# EAGLE board 8iPanel (EAGLE 6.6.0)
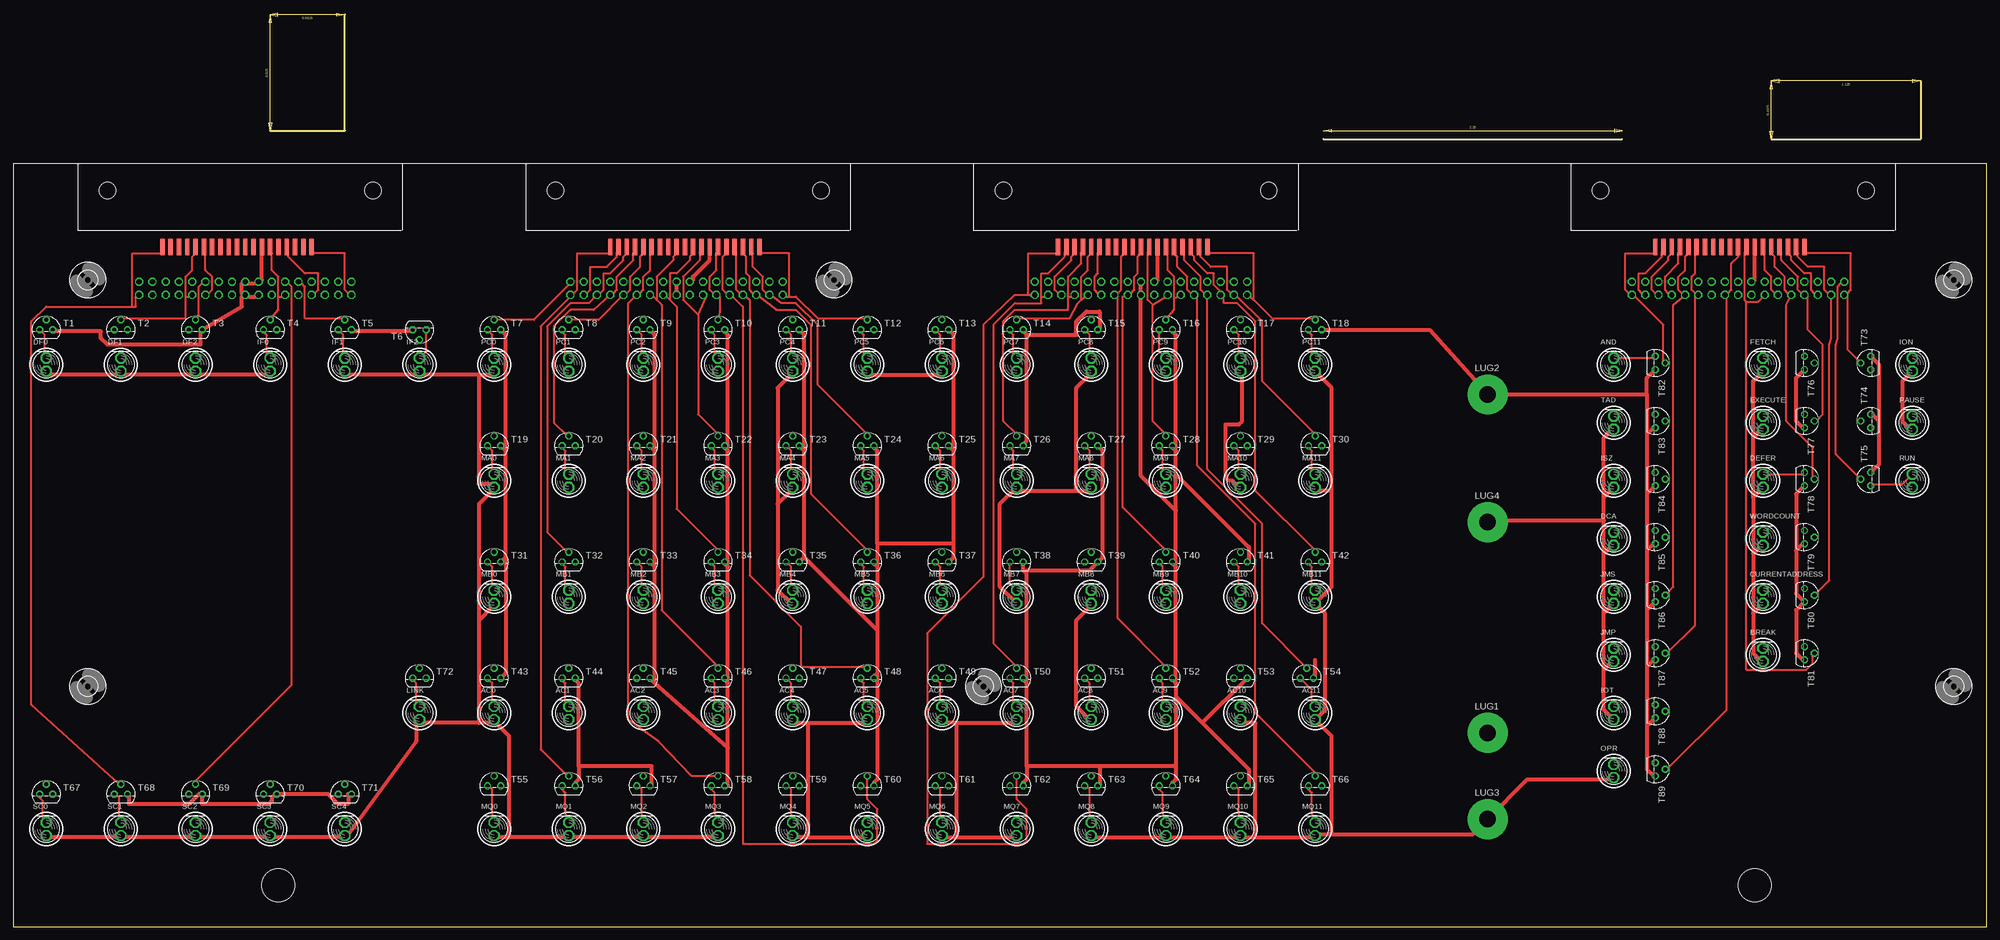
[diagram p2: board, top side]
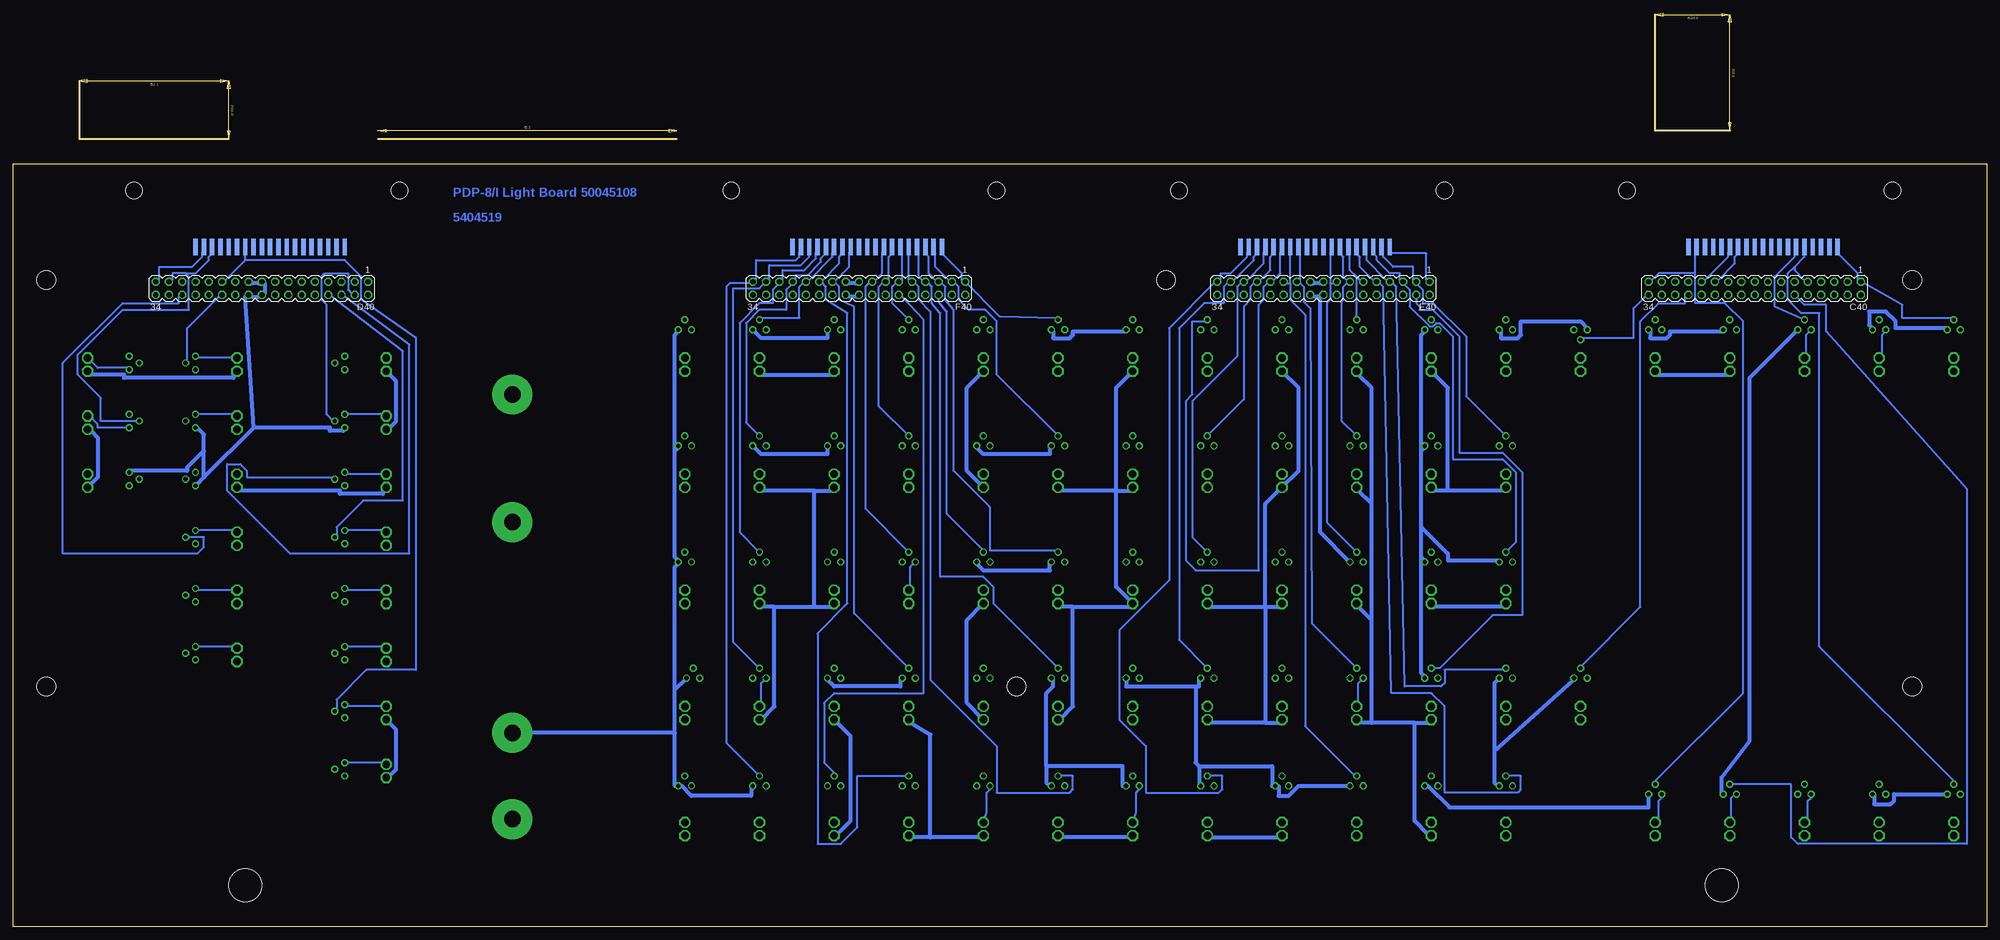
[diagram p3: board, bottom side, seen from below]

Size 377.82 x 174.62 mm. Coordinates in mm from the lower left corner, seen from the top.
Outline: 49.21,152.4 63.5,152.4 63.5,174.62
Outline: 336.55,150.81 365.12,150.81 365.12,161.93
Outline: 250.82,150.81 307.98,150.81
Outline: 0,0 377.82,0 377.82,146.05 0,146.05 0,0
Copper layers (1*16): Top 0.035mm / dielectric 1.5mm / Bottom 0.035mm
Design rules "15mils": minimum track width 15mil, minimum drill 24mil, track to track 15mil, track to pad 10mil, pad to pad 10mil, via to via 10mil, smd to smd 10mil, copper to edge 25mil, drill to drill 10mil, minimum pad ring 10mil, minimum via ring 8mil, stop-mask expansion 0mil, vias tented up to drill 0mil, thermal gap 10mil
Net classes: 1 supply: width 0.762 mm
Holes 6.35 mm at 50.8,7.94 333.38,7.94

## Footprints (pad centres in the part's own frame; a part is rotated, then mirrored left to right if it is on the bottom)
BULB = drill 1.422 octagon: A 0,0; B 0,2.54
MA17-2 = drill 1.016 octagon: 1 -20.32,-1.27; 2 -20.32,1.27; 3 -17.78,-1.27; 4 -17.78,1.27; 5 -15.24,-1.27; 6 -15.24,1.27; 7 -12.7,-1.27; 8 -12.7,1.27; 9 -10.16,-1.27; 10 -10.16,1.27; 11 -7.62,-1.27; 12 -7.62,1.27; 13 -5.08,-1.27; 14 -5.08,1.27; 15 -2.54,-1.27; 16 -2.54,1.27; 17 0,-1.27; 18 0,1.27; 19 2.54,-1.27; 20 2.54,1.27; 21 5.08,-1.27; 22 5.08,1.27; 23 7.62,-1.27; 24 7.62,1.27; 25 10.16,-1.27; 26 10.16,1.27; 27 12.7,-1.27; 28 12.7,1.27; 29 15.24,-1.27; 30 15.24,1.27; 31 17.78,-1.27; 32 17.78,1.27; 33 20.32,-1.27; 34 20.32,1.27
FLEX19 = smd 3.175 x 0.838: 1 0,14.287; 2 0,12.7; 3 0,11.113; 4 0,9.525; 5 0,7.938; 6 0,6.35; 7 0,4.763; 8 0,3.175; 9 0,1.587; 10 0,0; 11 0,-1.587; 12 0,-3.175; 13 0,-4.763; 14 0,-6.35; 15 0,-7.938; 16 0,-9.525; 17 0,-11.113; 18 0,-12.7; 19 0,-14.287
SPADELUG = drill 3.175 pad 7.62: 1 0,0
TO92 = drill 0.813 octagon: 1 1.27,0; 2 0,1.905; 3 -1.27,0
STRAIN-RELIEF = hole 3.175: 7.62,56.515; 7.62,5.715
3,6 = hole 3.6: 0,0

## Placement (x,y rotation side)
AC0  [BULB]  92.08,39.69 0 top
AC1  [BULB]  106.36,39.69 0 top
AC2  [BULB]  120.65,39.69 0 top
AC3  [BULB]  134.94,39.69 0 top
AC4  [BULB]  149.22,39.69 0 top
AC5  [BULB]  163.51,39.69 0 top
AC6  [BULB]  177.8,39.69 0 top
AC7  [BULB]  192.09,39.69 0 top
AC8  [BULB]  206.38,39.69 0 top
AC9  [BULB]  220.66,39.69 0 top
AC10  [BULB]  234.95,39.69 0 top
AC11  [BULB]  249.24,39.69 0 top
AND  [BULB]  306.39,106.36 0 top
BREAK  [BULB]  334.96,50.8 0 top
C40  [MA17-2]  44.45,122.24 180 bottom
C40BOT  FLEX19  [FLEX19]  42.86,130.18 90 top
C40TOP  FLEX19  [FLEX19]  42.86,130.18 270 bottom
CURRENTADDRESS  [BULB]  334.96,61.91 0 top
D40  [MA17-2]  330.2,122.24 180 bottom
D40BOT  FLEX19  [FLEX19]  128.59,130.18 90 top
D40TOP  FLEX19  [FLEX19]  128.59,130.18 270 bottom
DCA  [BULB]  306.39,73.03 0 top
DEFER  [BULB]  334.96,84.14 0 top
DF0  [BULB]  6.35,106.36 0 top
DF1  [BULB]  20.64,106.36 0 top
DF2  [BULB]  34.92,106.36 0 top
E40  [MA17-2]  127,122.24 180 bottom
E40BOT  FLEX19  [FLEX19]  214.31,130.18 90 top
E40TOP  FLEX19  [FLEX19]  214.31,130.18 270 bottom
EXECUTE  [BULB]  334.96,95.25 0 top
F40  [MA17-2]  215.9,122.24 180 bottom
F40BOT  FLEX19  [FLEX19]  328.61,130.18 90 top
F40TOP  FLEX19  [FLEX19]  328.61,130.18 270 bottom
FETCH  [BULB]  334.96,106.36 0 top
IF0  [BULB]  49.21,106.36 0 top
IF1  [BULB]  63.5,106.36 0 top
IF2  [BULB]  77.79,106.36 0 top
ION  [BULB]  363.54,106.36 0 top
IOT  [BULB]  306.39,39.69 0 top
ISZ  [BULB]  306.39,84.14 0 top
JMP  [BULB]  306.39,50.8 0 top
JMS  [BULB]  306.39,61.91 0 top
LINK  [BULB]  77.79,39.69 0 top
LUG1  LUG  [SPADELUG]  282.26,37.15 0 top
LUG2  LUG  [SPADELUG]  282.26,101.92 0 top
LUG3  LUG  [SPADELUG]  282.26,20.64 0 top
LUG4  LUG  [SPADELUG]  282.26,77.47 0 top
MA0  [BULB]  92.08,84.14 0 top
MA1  [BULB]  106.36,84.14 0 top
MA2  [BULB]  120.65,84.14 0 top
MA3  [BULB]  134.94,84.14 0 top
MA4  [BULB]  149.22,84.14 0 top
MA5  [BULB]  163.51,84.14 0 top
MA6  [BULB]  177.8,84.14 0 top
MA7  [BULB]  192.09,84.14 0 top
MA8  [BULB]  206.38,84.14 0 top
MA9  [BULB]  220.66,84.14 0 top
MA10  [BULB]  234.95,84.14 0 top
MA11  [BULB]  249.24,84.14 0 top
MB0  [BULB]  92.08,61.91 0 top
MB1  [BULB]  106.36,61.91 0 top
MB2  [BULB]  120.65,61.91 0 top
MB3  [BULB]  134.94,61.91 0 top
MB4  [BULB]  149.22,61.91 0 top
MB5  [BULB]  163.51,61.91 0 top
MB6  [BULB]  177.8,61.91 0 top
MB7  [BULB]  192.09,61.91 0 top
MB8  [BULB]  206.38,61.91 0 top
MB9  [BULB]  220.66,61.91 0 top
MB10  [BULB]  234.95,61.91 0 top
MB11  [BULB]  249.24,61.91 0 top
MQ0  [BULB]  92.08,17.46 0 top
MQ1  [BULB]  106.36,17.46 0 top
MQ2  [BULB]  120.65,17.46 0 top
MQ3  [BULB]  134.94,17.46 0 top
MQ4  [BULB]  149.22,17.46 0 top
MQ5  [BULB]  163.51,17.46 0 top
MQ6  [BULB]  177.8,17.46 0 top
MQ7  [BULB]  192.09,17.46 0 top
MQ8  [BULB]  206.38,17.46 0 top
MQ9  [BULB]  220.66,17.46 0 top
MQ10  [BULB]  234.95,17.46 0 top
MQ11  [BULB]  249.24,17.46 0 top
OPR  [BULB]  306.39,28.57 0 top
PAUSE  [BULB]  363.54,95.25 0 top
PC0  [BULB]  92.08,106.36 0 top
PC1  [BULB]  106.36,106.36 0 top
PC2  [BULB]  120.65,106.36 0 top
PC3  [BULB]  134.94,106.36 0 top
PC4  [BULB]  149.22,106.36 0 top
PC5  [BULB]  163.51,106.36 0 top
PC6  [BULB]  177.8,106.36 0 top
PC7  [BULB]  192.09,106.36 0 top
PC8  [BULB]  206.38,106.36 0 top
PC9  [BULB]  220.66,106.36 0 top
PC10  [BULB]  234.95,106.36 0 top
PC11  [BULB]  249.24,106.36 0 top
RUN  [BULB]  363.54,84.14 0 top
SC0  [BULB]  6.35,17.46 0 top
SC1  [BULB]  20.64,17.46 0 top
SC2  [BULB]  34.92,17.46 0 top
SC3  [BULB]  49.21,17.46 0 top
SC4  [BULB]  63.5,17.46 0 top
T1  2N2222  [TO92]  6.35,114.3 0 top
T2  2N2222  [TO92]  20.64,114.3 0 top
T3  2N2222  [TO92]  34.92,114.3 0 top
T4  2N2222  [TO92]  49.21,114.3 0 top
T5  2N2222  [TO92]  63.5,114.3 0 top
T6  2N2222  [TO92]  77.79,114.3 180 top
T7  2N2222  [TO92]  92.08,114.3 0 top
T8  2N2222  [TO92]  106.36,114.3 0 top
T9  2N2222  [TO92]  120.65,114.3 0 top
T10  2N2222  [TO92]  134.94,114.3 0 top
T11  2N2222  [TO92]  149.22,114.3 0 top
T12  2N2222  [TO92]  163.51,114.3 0 top
T13  2N2222  [TO92]  177.8,114.3 0 top
T14  2N2222  [TO92]  192.09,114.3 0 top
T15  2N2222  [TO92]  206.38,114.3 0 top
T16  2N2222  [TO92]  220.66,114.3 0 top
T17  2N2222  [TO92]  234.95,114.3 0 top
T18  2N2222  [TO92]  249.24,114.3 0 top
T19  2N2222  [TO92]  92.08,92.08 0 top
T20  2N2222  [TO92]  106.36,92.08 0 top
T21  2N2222  [TO92]  120.65,92.08 0 top
T22  2N2222  [TO92]  134.94,92.08 0 top
T23  2N2222  [TO92]  149.22,92.08 0 top
T24  2N2222  [TO92]  163.51,92.08 0 top
T25  2N2222  [TO92]  177.8,92.08 0 top
T26  2N2222  [TO92]  192.09,92.08 0 top
T27  2N2222  [TO92]  206.38,92.08 0 top
T28  2N2222  [TO92]  220.66,92.08 0 top
T29  2N2222  [TO92]  234.95,92.08 0 top
T30  2N2222  [TO92]  249.24,92.08 0 top
T31  2N2222  [TO92]  92.08,69.85 0 top
T32  2N2222  [TO92]  106.36,69.85 0 top
T33  2N2222  [TO92]  120.65,69.85 0 top
T34  2N2222  [TO92]  134.94,69.85 0 top
T35  2N2222  [TO92]  149.22,69.85 0 top
T36  2N2222  [TO92]  163.51,69.85 0 top
T37  2N2222  [TO92]  177.8,69.85 0 top
T38  2N2222  [TO92]  192.09,69.85 0 top
T39  2N2222  [TO92]  206.38,69.85 0 top
T40  2N2222  [TO92]  220.66,69.85 0 top
T41  2N2222  [TO92]  234.95,69.85 0 top
T42  2N2222  [TO92]  249.24,69.85 0 top
T43  2N2222  [TO92]  92.08,47.62 0 top
T44  2N2222  [TO92]  106.36,47.62 0 top
T45  2N2222  [TO92]  120.65,47.62 0 top
T46  2N2222  [TO92]  134.94,47.62 0 top
T47  2N2222  [TO92]  149.22,47.62 0 top
T48  2N2222  [TO92]  163.51,47.62 0 top
T49  2N2222  [TO92]  177.8,47.62 0 top
T50  2N2222  [TO92]  192.09,47.62 0 top
T51  2N2222  [TO92]  206.38,47.62 0 top
T52  2N2222  [TO92]  220.66,47.62 0 top
T53  2N2222  [TO92]  234.95,47.62 0 top
T54  2N2222  [TO92]  247.65,47.62 0 top
T55  2N2222  [TO92]  92.08,26.99 0 top
T56  2N2222  [TO92]  106.36,26.99 0 top
T57  2N2222  [TO92]  120.65,26.99 0 top
T58  2N2222  [TO92]  134.94,26.99 0 top
T59  2N2222  [TO92]  149.22,26.99 0 top
T60  2N2222  [TO92]  163.51,26.99 0 top
T61  2N2222  [TO92]  177.8,26.99 0 top
T62  2N2222  [TO92]  192.09,26.99 0 top
T63  2N2222  [TO92]  206.38,26.99 0 top
T64  2N2222  [TO92]  220.66,26.99 0 top
T65  2N2222  [TO92]  234.95,26.99 0 top
T66  2N2222  [TO92]  249.24,26.99 0 top
T67  2N2222  [TO92]  6.35,25.4 0 top
T68  2N2222  [TO92]  20.64,25.4 0 top
T69  2N2222  [TO92]  34.92,25.4 0 top
T70  2N2222  [TO92]  49.21,25.4 0 top
T71  2N2222  [TO92]  63.5,25.4 0 top
T72  2N2222  [TO92]  77.79,47.62 0 top
T73  2N2222  [TO92]  355.6,107.95 90 top
T74  2N2222  [TO92]  355.6,96.84 90 top
T75  2N2222  [TO92]  355.6,85.72 90 top
T76  2N2222  [TO92]  342.9,107.95 270 top
T77  2N2222  [TO92]  342.9,96.84 270 top
T78  2N2222  [TO92]  342.9,85.72 270 top
T79  2N2222  [TO92]  342.9,74.61 270 top
T80  2N2222  [TO92]  342.9,63.5 270 top
T81  2N2222  [TO92]  342.9,52.39 270 top
T82  2N2222  [TO92]  314.32,107.95 270 top
T83  2N2222  [TO92]  314.32,96.84 270 top
T84  2N2222  [TO92]  314.32,85.72 270 top
T85  2N2222  [TO92]  314.32,74.61 270 top
T86  2N2222  [TO92]  314.32,63.5 270 top
T87  2N2222  [TO92]  314.32,52.39 270 top
T88  2N2222  [TO92]  314.32,41.27 270 top
T89  2N2222  [TO92]  314.32,30.16 270 top
TAD  [BULB]  306.39,95.25 0 top
U$1  [STRAIN-RELIEF]  74.61,133.35 90 top
U$2  [STRAIN-RELIEF]  160.34,133.35 90 top
U$3  [STRAIN-RELIEF]  246.06,133.35 90 top
U$4  [STRAIN-RELIEF]  360.36,133.35 90 top
U$5  [3,6]  371.48,123.83 0 top
U$6  [3,6]  371.48,46.04 0 top
U$7  [3,6]  185.74,46.04 0 top
U$8  [3,6]  14.29,46.04 0 top
U$9  [3,6]  14.29,123.83 0 top
U$11  [3,6]  157.16,123.83 0 top
WORDCOUNT  [BULB]  334.96,73.03 0 top

## Tracks (layer width: path | path; a pad name or v marks a point on that pad's centre or on a via)
+15V
  Top 0.762: ION.A 361.63,104.46 361.63,96.84 362.9,95.57 PAUSE.A | 333.06,60.01 333.06,52.39 334.33,51.12 BREAK.A | 333.06,60.01 CURRENTADDRESS.A | 333.06,71.44 334.33,72.71 WORDCOUNT.A | 333.06,71.44 333.06,60.01 | 333.06,82.23 333.06,71.44 | DEFER.A 333.06,82.23 | 333.06,93.66 334.33,94.93 EXECUTE.A | 333.06,82.23 333.06,93.66 | 333.06,93.66 333.06,104.46 FETCH.A | 304.48,49.21 305.75,50.48 JMP.A | 304.48,49.21 304.48,41.59 IOT.A | 304.48,49.21 304.48,60.01 | 304.48,60.01 JMS.A | 304.48,71.44 305.75,72.71 DCA.A | 304.48,60.01 304.48,71.44 | 304.48,71.44 304.48,77.79 | 304.48,77.79 304.48,82.23 | 304.48,82.23 ISZ.A | 304.48,82.23 304.48,93.66 305.75,94.93 TAD.A | OPR.A 305.75,28.26 289.88,28.26 LUG3.1 279.4,17.78 252.41,17.78 | 252.41,83.5 249.87,83.5 MA11.A | DF0.A 6.67,105.73 20,105.73 DF1.A 21.27,105.73 34.61,105.73 DF2.A 35.24,105.73 48.58,105.73 IF0.A | IF1.A 63.82,105.73 77.15,105.73 IF2.A 78.42,105.73 89.22,105.73 | 89.22,105.73 91.76,105.73 PC0.A | 89.22,105.73 89.22,84.77 91.76,84.77 MA0.A 91.76,83.5 89.22,80.96 89.22,58.74 | PC5.A 164.15,105.73 177.48,105.73 PC6.A | 203.52,83.5 206.06,83.5 MA8.A | 203.52,83.5 192.72,83.5 MA7.A 188.91,80.96 188.91,65.09 MB7.A | 203.52,83.5 203.52,103.19 206.06,105.73 PC8.A | 180.66,39.05 191.45,39.05 AC7.A | 180.66,39.05 178.12,39.05 AC6.A | 146.37,80.96 148.91,83.5 MA4.A | 146.37,80.96 146.37,64.45 148.91,61.91 MB4.A | 146.37,80.96 146.37,103.19 148.91,105.73 PC4.A | SC0.A 6.99,17.14 20.32,17.14 SC1.A 20.95,17.14 34.29,17.14 SC2.A 35.56,17.14 48.9,17.14 SC3.A 49.53,17.14 62.87,17.14 SC4.A 64.14,17.78 77.15,35.56 77.15,39.05 LINK.A 78.42,39.05 89.22,39.05
  Top 0.762: AC10.A 235.27,39.05 237.81,39.05 237.81,17.14 | AC11.A 248.6,39.05 | AC11.A 251.14,41.59 251.14,60.01 MB11.A 252.41,65.09 252.41,83.5 | 152.08,39.05 149.54,39.05 AC4.A | 152.08,39.05 162.88,39.05 AC5.A | 89.22,39.05 91.76,39.05 AC0.A 92.39,39.05 94.93,36.51 94.93,17.14 | 94.93,17.14 105.73,17.14 MQ1.A 107,17.14 120.33,17.14 MQ2.A 120.97,17.14 134.3,17.14 MQ3.A | 94.93,17.14 92.39,17.14 MQ0.A | 152.08,17.14 149.54,17.14 MQ4.A | 152.08,17.14 162.88,17.14 MQ5.A | 180.66,17.14 178.12,17.14 MQ6.A | 180.66,17.14 191.45,17.14 MQ7.A | MB8.A 206.06,61.28 203.52,58.74 203.52,42.23 206.06,39.69 AC8.A | MQ8.A 206.69,17.14 220.03,17.14 MQ9.A 221.3,17.14 234.63,17.14 MQ10.A 235.27,17.14 237.81,17.14 | 237.81,17.14 248.6,17.14 MQ11.A 249.87,17.78 252.41,17.78 | 89.22,58.74 91.76,61.28 MB0.A | 89.22,39.05 89.22,58.74 | 152.08,39.05 152.08,17.14 | 180.66,17.14 180.66,39.05 | 252.41,83.5 252.41,103.19 PC11.A | 252.41,17.78 252.41,36.51 AC11.A | PC10.A 235.27,105.73 235.27,96.84 234.63,96.2 232.09,96.2 232.09,86.04 232.73,85.41 233.36,85.41 234,84.77 234.63,84.77 MA10.A | 304.48,77.79 285.75,77.79 LUG4.1
  Bottom 0.762: RUN.A 361.63,86.04 361.63,93.66 362.9,94.93 PAUSE.A | ION.A 362.9,105.73 356.55,105.73 356.55,105.09 335.6,105.09 335.6,105.73 FETCH.A | 232.09,61.28 224.47,61.28 | 224.47,61.28 221.3,61.28 MB9.A | 232.09,61.28 234.63,61.28 MB10.A | OPR.A 305.75,28.89 304.48,30.16 304.48,37.78 IOT.A | AND.A 304.48,104.46 304.48,96.84 305.75,95.57 TAD.A | DEFER.A 334.33,83.5 315.28,83.5 315.28,82.87 307.02,82.87 307.02,83.5 ISZ.A | 103.19,83.5 105.73,83.5 MA1.A | 103.19,83.5 92.39,83.5 MA0.A | 103.19,83.5 103.19,103.19 PC1.A | IF1.A 63.18,105.73 49.85,105.73 IF0.A | 174.94,61.28 177.48,61.28 MB6.A | 174.94,61.28 164.15,61.28 MB5.A 166.69,65.09 166.69,83.5 | 166.69,83.5 177.48,83.5 MA6.A | 166.69,83.5 164.15,83.5 MA5.A | 166.69,83.5 166.69,103.19 PC5.A | PC7.A 195.26,103.19 195.26,87.31 MA7.A | MB7.A 195.26,58.74 195.26,42.86 AC7.A | 174.94,61.28 174.94,42.23 177.48,39.69 AC6.A | 117.79,39.05 120.33,39.05 AC2.A | 109.54,39.05 117.79,39.05 | 109.54,39.05 107,39.05 AC1.A | 117.79,58.74 120.33,61.28 MB2.A | 117.79,39.05 117.79,58.74 | 117.79,80.96 120.33,83.5 MA2.A | 117.79,58.74 117.79,80.96 | 117.79,80.96 117.79,103.19 120.33,105.73 PC2.A | 138.11,61.28 148.91,61.28 MB4.A | 138.11,61.28 135.57,61.28 MB3.A | 138.11,61.28 138.11,80.96 MA3.A 131.76,87.31 131.76,103.19 PC3.A | 138.11,39.05 148.91,39.05 AC4.A | 138.11,39.05 135.57,39.05 AC3.A | MB0.A 92.39,61.28 105.73,61.28 MB1.A | MQ4.A 148.91,17.14 135.57,17.14 MQ3.A | MQ6.A 177.48,17.14 164.15,17.14 MQ5.A | 202.25,17.14 192.72,17.14 MQ7.A | 202.25,17.14 206.06,17.14 MQ8.A | 202.25,17.14 202.25,36.83 206.06,39.05 AC8.A | AC9.A 217.49,36.51 217.49,20.32 220.03,17.78 MQ9.A
  Bottom 0.762: 138.11,61.28 138.11,39.05 | 109.54,39.05 109.54,20.32 107,17.78 MQ1.A | 232.09,61.28 232.09,42.23 234.63,39.69 AC10.A | PC9.A 221.3,105.73 234.63,105.73 PC10.A | 224.47,83.5 221.3,83.5 MA9.A | 224.47,61.28 224.47,83.5 | 224.47,83.5 234.63,83.5 MA10.A
AC0
  Bottom 0.381: T43.2 92.39,49.21 103.82,49.21 103.82,46.67 104.46,46.04 111.44,46.04 113.03,122.56 113.67,123.19 E40.7 114.94,123.83 118.75,127.64 118.75,128.91 D40TOP.4
AC1
  Top 0.381: D40BOT.2 115.57,128.91 115.57,128.27 113.67,126.36 110.49,126.36 110.49,121.92 109.86,121.28 E40.4
  Bottom 0.381: T44.2 104.78,49.53 94.61,59.69 88.9,59.69 88.9,87 92.71,90.81 100.97,90.81 100.97,113.03 106.05,118.11 108.58,118.11 108.58,118.75 109.22,119.38 E40.4
AC2
  Bottom 0.381: T45.2 129.22,58.1 129.54,118.43 130.81,119.7 130.81,122.56 131.44,123.19 E40.21 131.44,123.83 131.44,128.91 D40TOP.12
AC3
  Top 0.381: 123.19,120.02 122.56,120.65 E40.14 | 123.19,120.02 124.14,119.06 124.14,60.64 134.94,49.85 T46.2 | 123.19,120.02 123.19,124.46 126.36,127.64 126.36,128.27 127,128.91 D40BOT.9
AC4
  Bottom 0.381: T47.2 154.62,54.93 154.62,114.62 149.86,119.38 146.05,119.38 146.05,122.56 145.41,123.19 E40.31 144.15,123.83 140.34,127.64 140.34,128.27 139.7,128.91 D40TOP.17
AC5
  Top 0.381: T48.2 163.51,49.85 150.81,49.85 150.81,57.47 140.97,67.31 140.97,120.02 140.34,120.65 E40.28 139.06,121.28 138.43,121.92 138.43,128.91 D40BOT.16
AC6
  Bottom 0.381: T49.2 190.18,61.91 190.18,65.09 192.09,66.99 200.34,66.99 200.34,117.47 201.93,119.38 201.93,122.56 202.56,123.19 F40.7 203.84,123.83 204.47,124.46 204.47,128.91 E40TOP.4
AC7
  Top 0.381: 196.85,120.65 197.49,120.65 F40.4 | T50.2 192.09,49.85 187.64,54.29 187.64,115.25 191.77,119.38 196.85,119.38 196.85,120.65 | 196.85,120.65 196.85,125.09 198.12,125.09 201.29,128.27 201.29,128.91 E40BOT.2
AC8
  Bottom 0.381: T51.2 216.85,60.01 216.85,118.75 219.71,120.02 219.71,122.56 220.34,123.19 F40.21 220.34,123.83 217.81,126.36 217.81,128.91 E40TOP.12
AC9
  Top 0.381: T52.2 220.66,49.85 211.46,59.05 211.46,120.65 F40.14 211.46,121.28 212.09,121.92 212.09,128.27 212.72,128.91 E40BOT.9
AC10
  Bottom 0.381: E40TOP.17 225.43,128.27 227.01,126.68 233.04,126.68 233.04,123.83 F40.31 234.95,122.24 240.03,122.24 240.03,54.61 T53.2
AC11
  Top 0.381: T54.2 239.08,58.1 239.08,77.15 228.6,87.63 F40.28 227.97,121.28 227.33,121.92 227.33,124.46 224.16,127.64 224.16,128.91 E40BOT.16
AND
  Top 0.381: T82.2 315.91,108.27 315.91,115.25 310.51,120.65 D40.2 309.25,121.28 308.61,121.92 308.61,128.91 314.32,128.91 F40BOT.1
BREAK
  Top 0.381: 331.79,119.7 331.79,49.21 343.22,49.21 344.49,50.48 344.49,52.39 T81.2 | 331.79,119.7 334.01,119.7 D40.22 | 331.79,119.7 331.47,120.02 331.47,128.91 F40BOT.12
CA
  Top 0.381: T80.2 347.66,66.36 347.66,111.44 347.98,112.71 D40.32 347.35,121.28 346.71,121.92 346.71,126.36 343.54,126.36 341.63,128.27 341.63,128.91 F40BOT.18
DCA
  Top 0.381: F40BOT.4 318.77,128.91 318.77,127 316.23,124.46 316.23,121.92 316.87,121.28 D40.8
  Bottom 0.381: T85.2 315.91,74.61 315.91,76.52 310.83,81.6 303.21,81.6 303.21,110.17 316.87,120.65 D40.8
DEFER
  Top 0.381: T78.2 344.49,86.04 344.49,91.76 339.41,96.84 339.41,119.06 D40.26 339.73,121.28 339.09,121.92 339.09,124.46 337.19,126.36 337.19,128.27 336.55,128.91 F40BOT.15
DF0
  Bottom 0.381: T1.2 6.67,116.52 16.19,116.52 16.19,119.06 23.5,123.19 C40.1 24.77,123.83 24.77,125.09 28.57,128.91 C40TOP.1
DF1
  Top 0.381: 33.02,120.65 33.66,120.65 C40.10 | T2.2 20.64,116.52 33.02,116.52 33.02,120.65 | 33.02,120.65 33.02,124.46 34.29,125.73 34.29,128.27 34.92,128.91 C40BOT.5
DF2
  Top 0.381: T3.2 35.56,117.16 35.56,122.56 36.2,123.19 C40.11
  Bottom 0.381: C40TOP.6 36.83,128.91 36.83,128.27 40.64,124.46 40.64,118.75 T3.2
EXECUTE
  Top 0.381: T77.2 345.12,96.84 346.39,98.11 346.39,111.44 343.54,114.3 343.54,120.65 D40.28 342.26,121.28 341.63,121.92 341.63,124.46 338.45,127.64 338.45,128.91 F40BOT.16
FETCH
  Top 0.381: F40BOT.14 335.28,128.91 335.28,125.73 336.55,124.46 336.55,121.92 337.19,121.28 D40.24
  Bottom 0.381: T76.2 344.49,108.27 344.49,114.62 338.45,120.65 D40.24
GND
  Top 0.762: T76.1 341.31,105.09 341.31,96.84 342.58,95.57 T77.1 | 357.19,96.84 357.19,88.58 T75.1 | 357.19,96.84 355.92,98.11 T74.1 | 357.19,96.84 357.19,107.63 T73.1 | 312.74,38.42 312.74,30.16 314.01,28.89 T89.1 | 312.74,38.42 T88.1 | 312.74,49.85 314.01,51.12 T87.1 | 312.74,49.85 312.74,38.42 | 312.74,60.64 312.74,49.85 | 312.74,60.64 T86.1 | 312.74,72.07 314.01,73.34 T85.1 | 312.74,72.07 312.74,60.64 | 312.74,82.87 312.74,72.07 | 312.74,82.87 T84.1 | 312.74,94.3 314.01,95.57 T83.1 | 312.74,94.3 312.74,82.87 | 312.74,101.92 312.74,94.3 | 312.74,101.92 312.74,105.09 T82.1 | 222.57,46.67 222.57,44.13 | 222.57,44.13 222.57,30.8 | 222.57,30.8 222.57,28.26 221.93,27.62 T64.1 | 222.57,46.67 221.93,47.31 T52.1 | 222.57,68.9 221.93,69.53 T40.1 | 222.57,46.67 222.57,68.9 | 222.57,91.12 221.93,91.76 T28.1 | 222.57,68.9 222.57,79.69 | 222.57,79.69 222.57,86.68 | 222.57,86.68 222.57,91.12 | 222.57,44.13 227.65,39.05 | 227.65,39.05 236.54,30.16 236.54,26.99 T65.1 | 249.24,51.12 249.24,47.94 T54.1 | 312.74,101.92 LUG2.1 271.14,114.3 T18.1 | 193.99,113.35 193.99,93.03 193.36,92.39 T26.1 | 193.99,113.35 193.36,113.98 T14.1 | 193.99,30.8 193.99,46.67 | 193.99,30.8 193.99,28.26 193.36,27.62 T62.1 | 193.99,46.67 193.36,47.31 T50.1 | 207.96,30.8 207.96,26.99 T63.1 | 207.96,30.8 193.99,30.8 | 193.99,113.35 203.52,113.35 203.52,115.89 205.42,117.79 207.96,117.79 207.96,114.62 T15.1 | 108.27,30.8 108.27,46.67 107.63,47.31 T44.1 | 108.27,30.8 108.27,28.26 107.63,27.62 T56.1 | 108.27,30.8 122.24,30.8 122.24,26.99 T57.1 | T1.1 7.94,113.98 16.83,113.98 16.83,112.71 18.1,111.44 35.88,111.44 35.88,113.98 T3.1 43.81,118.75 43.81,120.65 C40.18
  Top 0.762: T71.1 64.14,25.4 64.14,23.5 62.23,23.5 60.33,25.4 T70.1 50.16,25.4 49.53,24.77 49.53,24.13 48.9,23.5 36.2,23.5 T69.1 35.56,25.4 33.66,23.5 22.23,23.5 22.23,25.4 T68.1 | T6.1 76.52,113.98 65.09,113.98 T5.1 | 227.65,39.05 T53.1 | C40.18 45.09,120.65 46.35,120.65 C40.20 | C40BOT.13 47.62,123.83 C40.19 46.35,123.19 45.09,123.19 C40.17 43.81,123.19 43.81,121.28 C40.18 | F40BOT.13 333.38,123.83 D40.19 | T81.1 342.58,51.12 341.31,52.39 341.31,60.64 T80.1 341.31,63.82 341.31,72.07 | 341.31,72.07 342.58,73.34 T79.1 | D40BOT.13 133.35,127.64 130.18,124.46 130.18,123.83 E40.19 | E40.18 E40.17 | 136.84,46.67 136.21,47.31 T46.1 | 136.84,34.29 136.84,26.99 T58.1 | 136.84,34.29 136.84,46.67 | 136.84,68.9 136.21,69.53 T34.1 | 136.84,46.67 136.84,68.9 | 136.84,91.12 136.21,91.76 T22.1 | 136.84,68.9 136.84,91.12 | 136.84,91.12 136.84,113.35 136.21,113.98 T10.1 | 136.84,34.29 122.87,46.67 | 122.87,46.67 T45.1 | E40BOT.13 219.07,123.83 F40.19 | F40.17 F40.18 215.9,86.36 222.57,79.69 | 222.57,91.12 222.57,113.35 221.93,113.98 T16.1 | 94.3,91.12 T19.1 | 94.3,70.8 94.3,91.12 | T31.1 94.3,70.8 | T7.1 94.3,113.35 94.3,91.12 | 122.87,68.9 T33.1 | 122.87,46.67 122.87,68.9 | 122.87,91.12 T21.1 | 122.87,68.9 122.87,91.12 | T9.1 122.87,113.35 122.87,91.12 | 151.45,70.8 T35.1 | 151.45,70.8 151.45,91.12 | 151.45,91.12 T23.1 | T11.1 151.45,113.35 151.45,91.12 | 180.02,91.12 T25.1 | 180.02,73.34 180.02,70.8 T37.1 | 180.02,73.34 180.02,91.12 | T13.1 180.02,113.35 180.02,91.12 | 165.42,68.9 164.78,69.53 T36.1 | 165.42,56.83 165.42,48.58 | 165.42,68.9 165.42,56.83 | 165.42,48.58 164.78,47.94 T48.1 | 165.42,73.34 165.42,91.12 164.78,91.76 T24.1
  Top 0.762: 165.42,73.34 165.42,68.9 | 165.42,48.58 165.42,28.26 164.78,27.62 T60.1 | 165.42,56.83 151.45,70.8 | 180.02,73.34 165.42,73.34 | 222.57,30.8 207.96,30.8 | 193.36,68.26 206.06,68.26 T39.1 208.6,70.8 208.6,91.12 T27.1 | 193.36,68.26 T38.1 | 222.57,86.68 236.54,72.71 236.54,70.17 T41.1 | T43.1 94.3,48.58 94.3,70.8 | 193.36,68.26 193.99,67.63 193.99,46.67 | T78.1 341.31,82.87 341.31,72.07
  Bottom 0.762: T65.1 236.54,26.99 236.54,25.08 247.97,25.08 249.87,26.99 T66.1 251.14,26.99 251.14,37.15 | T12.1 164.78,113.98 174.94,113.98 174.94,113.35 175.58,112.71 178.75,112.71 178.75,113.98 T13.1 | T38.1 193.36,69.53 192.09,68.26 179.39,68.26 179.39,69.53 T37.1 | 150.81,30.8 150.81,26.99 T59.1 | T47.1 150.81,47.31 150.81,46.04 151.45,46.04 | 151.45,46.04 164.78,46.04 T48.1 | T57.1 131.76,26.99 133.67,25.08 135.57,25.08 135.57,26.99 T58.1 136.84,26.99 136.84,30.8 150.81,30.8 | T1.1 7.94,114.62 17.46,114.62 17.46,115.89 19.37,117.79 22.54,117.79 22.54,115.25 21.91,114.62 T2.1 | T67.1 17.78,25.4 17.78,24.13 18.41,23.5 21.59,23.5 21.59,25.4 T68.1 | T4.1 50.48,113.98 60.64,113.98 60.64,113.35 61.28,112.71 64.45,112.71 64.45,113.98 T5.1 | 108.27,91.12 107.63,91.76 T20.1 | 108.27,70.8 108.27,76.52 | 108.27,76.52 108.27,91.12 | 108.27,70.8 107.63,70.17 T32.1 | 108.27,91.12 108.27,113.35 107.63,113.98 T8.1 | T6.1 76.52,114.62 77.79,115.89 89.22,115.89 89.22,113.35 89.85,112.71 93.03,112.71 93.03,113.98 T7.1 | 108.27,70.8 108.27,48.58 107.63,47.94 T44.1 | T52.1 221.93,47.31 220.66,46.04 207.96,46.04 207.96,47.31 T51.1 | 251.14,91.12 251.14,70.8 250.51,70.17 T42.1 250.51,69.53 251.14,68.9 251.14,45.4 | 251.14,91.12 250.51,91.76 T30.1 | 251.14,91.12 251.14,113.35 250.51,113.98 T18.1 | 251.14,37.15 251.14,45.4 | 251.14,45.4 T54.1 | 251.14,37.15 LUG1.1 | D40.19 332.11,123.19 330.83,123.19 D40.17 329.56,123.19 329.56,121.28 D40.18 330.83,120.65 332.11,120.65 D40.20 333.38,120.65 331.79,95.57 | 127.64,120.65 128.91,120.65 E40.20 | E40.17 127.64,123.19 128.91,123.19 E40.19 | 127.64,120.65 127.64,75.56 T33.1
  Bottom 0.762: 127.64,120.65 E40.18 | F40.18 216.53,120.65 217.81,120.65 F40.20 | F40.17 216.53,123.19 217.81,123.19 F40.19 | T29.1 234.63,90.49 221.93,90.49 T28.1 | 108.27,76.52 103.19,71.44 103.19,70.17 93.66,70.17 T31.1 | T26.1 193.36,91.76 192.09,90.49 179.39,90.49 179.39,91.76 T25.1 | T17.1 234.63,112.71 221.93,112.71 T16.1 | T3.1 45.4,105.09 45.4,35.56 50.8,28.57 50.8,25.4 T70.1 | 94.3,33.66 94.3,46.67 T43.1 | 94.3,33.66 94.3,27.62 93.66,26.99 T55.1 | 94.3,33.66 79.06,47.31 T72.1 | T71.1 64.77,22.86 102.87,22.86 107,26.99 T56.1 | 150.81,30.8 151.45,31.43 151.45,46.04 | 180.02,30.8 180.02,44.77 178.75,46.04 178.75,47.31 T49.1 | 180.02,30.8 180.02,27.62 179.39,26.99 T61.1 | 180.02,30.8 165.42,30.8 165.42,26.99 T60.1 | 341.31,86.04 T78.1 | 341.31,91.12 341.31,94.3 342.58,95.57 T77.1 | 341.31,86.04 341.31,91.12 | 331.79,95.57 341.31,86.04 | 341.31,91.12 344.49,87.95 344.49,87.31 355.28,87.31 T75.1 | 331.79,95.57 317.18,95.57 317.18,94.93 314.64,94.93 314.64,95.57 T83.1
IF0
  Top 0.381: 50.8,120.65 51.44,120.65 C40.24 | 50.8,120.65 50.8,118.11 T4.2 | 50.8,120.65 50.8,124.46 49.53,125.73 49.53,128.91 C40BOT.14
IF1
  Top 0.381: T5.2 63.18,116.52 55.88,116.52 55.88,122.56 55.24,123.19 C40.25
  Bottom 0.381: C40TOP.14 49.53,128.91 49.53,128.27 53.98,123.83 C40.25
IF2
  Top 0.381: C40BOT.19 57.15,128.91 63.5,128.91 63.5,121.92 64.14,121.28 C40.34
  Bottom 0.381: T6.2 77.79,112.71 67.63,112.71 67.63,118.43 65.41,120.65 C40.34
ION
  Top 0.381: T73.2 351.15,110.49 351.15,120.65 D40.34 351.15,121.28 351.79,121.92 351.79,128.91 342.9,128.91 F40BOT.19
IOT
  Bottom 0.381: 333.38,127.64 314.32,127.64 311.15,124.46 311.15,120.02 300.67,112.71 300.67,49.21 310.2,49.21 315.91,43.5 315.91,41.59 T88.2 | 333.38,127.64 F40TOP.13 | 333.38,127.64 337.19,123.83 D40.23
ISZ
  Top 0.381: F40BOT.3 317.5,128.91 316.87,128.27 316.87,127.64 313.69,124.46 313.69,121.92 314.32,121.28 D40.6
  Bottom 0.381: T84.2 316.55,86.04 333.06,86.04 333.06,87.31 334.33,88.58 336.87,88.58 336.87,83.5 324.8,71.44 301.94,71.44 301.94,111.44 314.32,120.65 D40.6
JMP
  Top 0.381: T87.2 316.55,52.39 321.94,57.78 321.94,120.65 D40.12 321.94,121.28 321.31,121.92 321.31,124.46 321.94,125.09 321.94,128.91 F40BOT.6
JMS
  Top 0.381: T86.2 317.82,65.09 317.82,119.06 D40.10 319.4,121.28 318.77,121.92 318.77,124.46 320.04,125.73 320.04,128.27 320.68,128.91 F40BOT.5
LINK
  Top 0.381: C40BOT.16 52.7,128.91 52.7,128.27 55.88,125.09 58.42,125.09 58.42,121.92 57.78,121.28 C40.28
  Bottom 0.381: T72.2 77.79,49.85 66.36,61.28 66.36,115.89 62.87,119.38 57.78,119.38 57.78,120.65 C40.28
MA0
  Bottom 0.381: D40TOP.2 115.57,128.91 115.57,128.27 113.67,126.36 109.86,126.36 109.86,123.83 E40.3 109.22,123.19 107.95,121.92 107.95,119.38 106.05,119.38 99.69,113.03 99.69,101.6 T19.2
MA1
  Top 0.381: D40BOT.4 118.75,128.91 118.75,127.64 115.57,124.46 115.57,121.92 114.94,121.28 E40.8 111.12,118.11 106.68,118.11 103.5,114.94 103.5,96.52 106.05,93.98 T20.2
MA2
  Bottom 0.381: D40TOP.7 123.83,128.91 123.19,128.27 123.19,124.46 122.56,123.83 E40.13 | 123.51,119.7 123.51,96.84 T21.2
  Bottom 0.406: E40.13 122.24,123.51 123.19,122.56 123.19,120.02 123.51,119.7
MA3
  Top 0.381: 131.13,117.16 132.72,120.65 E40.22 | 131.13,117.16 131.13,98.11 134.94,94.3 T22.2 | 131.13,117.16 128.27,120.02 128.27,124.46 131.44,127.64 131.44,128.91 D40BOT.12
MA4
  Bottom 0.381: T23.2 142.24,100.97 142.24,118.75 140.97,120.02 140.97,122.56 140.34,123.19 E40.27 139.06,123.83 137.16,125.73 137.16,128.27 136.53,128.91 D40TOP.15
MA5
  Top 0.381: D40BOT.18 141.6,128.91 141.6,126.36 143.51,124.46 143.51,121.92 144.15,121.28 E40.32 145.41,120.65 147,119.38 149.86,119.38 153.99,115.25 153.99,103.82 163.51,94.3 T24.2
MA6
  Bottom 0.381: T25.2 189.55,105.73 189.55,115.89 191.77,118.11 194.94,118.11 196.85,120.02 196.85,122.56 197.49,123.19 F40.3 198.75,123.83 201.29,126.36 201.29,128.91 E40TOP.2
MA7
  Top 0.381: 201.93,120.65 202.56,120.65 F40.8 | T26.2 192.09,94.3 189.55,96.84 189.55,115.89 191.77,118.11 201.93,118.11 201.93,120.65 | 201.93,120.65 201.93,124.46 204.47,127 204.47,128.91 E40BOT.4
MA8
  Bottom 0.381: T27.2 212.09,99.69 212.09,122.56 211.46,123.19 F40.13 210.19,123.83 210.19,128.27 209.55,128.91 E40TOP.7
MA9
  Top 0.381: 218.12,119.06 219.71,120.02 220.66,120.65 F40.22 | 218.12,119.06 218.12,96.84 220.66,94.3 T28.2 | 218.12,119.06 217.17,120.02 217.17,128.91 E40BOT.12
MA10
  Bottom 0.381: E40TOP.15 222.25,128.91 223.2,127.95 223.2,127.32 225.74,124.78 227.97,124.78 227.97,123.83 F40.27 228.6,123.19 229.87,121.92 229.87,118.11 234.95,118.11 237.49,115.57 237.49,96.52 T29.2
MA11
  Top 0.381: E40BOT.18 227.33,128.91 227.33,128.27 229.24,126.36 232.41,126.36 232.41,121.92 233.04,121.28 F40.32 234.31,120.65 239.08,115.89 239.08,104.46 249.24,94.3 T30.2
MB0
  Bottom 0.381: D40TOP.3 117.47,128.91 116.84,128.27 116.84,127.64 114.3,125.09 112.39,125.09 112.39,123.83 E40.5 111.76,123.19 110.49,121.92 110.49,118.75 106.68,114.94 106.05,114.94 105.41,115.57 104.78,115.57 102.23,113.03 102.23,89.53 92.71,89.53 90.17,87 90.17,73.66 T31.2
MB1
  Top 0.381: D40BOT.3 117.47,128.91 116.84,128.27 116.84,127.64 114.3,125.09 113.03,125.09 113.03,121.92 112.39,121.28 E40.6 110.17,119.38 106.68,119.38 102.23,114.94 102.23,75.56 106.05,71.75 T32.2
MB2
  Bottom 0.381: 125.73,123.19 125.73,128.91 D40TOP.8 | 125.73,123.19 125.09,123.19 E40.15 | T33.2 126.36,77.47 126.36,119.38 125.73,120.02 125.73,123.19
MB3
  Top 0.381: 125.73,120.02 125.09,120.65 E40.16 | 125.73,120.02 127,118.75 127,80.01 134.94,72.07 T34.2 | 125.73,120.02 125.73,125.09 127,125.09 129.54,127.64 129.54,128.27 130.18,128.91 D40BOT.11
MB4
  Bottom 0.381: T35.2 152.08,74.61 152.08,100.65 143.51,109.22 143.51,122.56 142.88,123.19 E40.29 141.6,123.83 138.43,127 138.43,128.91 D40TOP.16
MB5
  Top 0.381: D40BOT.17 139.7,128.91 140.34,128.27 140.34,125.09 140.97,124.46 140.97,121.92 141.6,121.28 E40.30 142.88,120.65 146.05,118.11 149.86,118.11 152.72,115.25 152.72,82.87 163.51,72.07 T36.2
MB6
  Bottom 0.381: T37.2 178.12,72.07 190.82,72.07 190.82,80.33 197.8,87.31 197.8,118.11 199.39,120.02 199.39,122.56 200.03,123.19 F40.5 201.29,123.83 202.56,125.09 202.56,128.27 203.2,128.91 E40TOP.3
MB7
  Top 0.381: E40BOT.3 203.2,128.91 202.56,128.27 202.56,127.64 199.39,124.46 199.39,121.92 200.03,121.28 F40.6
  Bottom 0.381: T38.2 192.09,72.07 199.07,79.06 199.07,117.79 200.66,119.7 F40.6
MB8
  Bottom 0.381: T39.2 214.63,80.01 214.63,122.56 214,123.19 F40.15 212.72,123.83 211.46,125.09 211.46,128.91 E40TOP.8
MB9
  Top 0.381: T40.2 220.66,72.07 212.41,80.33 212.41,120.65 F40.16 214,121.28 214.63,121.92 214.63,124.46 215.26,125.09 215.26,128.27 215.9,128.91 E40BOT.11
MB10
  Bottom 0.381: E40TOP.16 224.16,128.91 224.16,127.95 226.38,125.73 230.5,125.73 230.5,123.83 F40.29 231.14,123.19 232.41,121.92 232.41,119.38 234.95,119.38 238.76,115.57 238.76,75.56 T41.2
MB11
  Top 0.381: E40BOT.17 225.43,128.91 226.06,128.27 226.06,127.64 228.6,125.09 229.87,125.09 229.87,122.87 231.14,121.6 F40.30 231.78,120.65 231.78,119.38 234.31,119.38 237.81,115.89 237.81,83.5 249.24,72.07 T42.2
MQ0
  Bottom 0.381: T55.2 89.22,28.89 89.22,26.35 89.85,25.72 103.82,25.72 103.82,42.23 106.36,44.77 113.98,44.77 115.57,122.56 116.2,123.19 E40.9 117.47,123.83 120.02,126.36 120.02,128.27 120.65,128.91 D40TOP.5
MQ1
  Top 0.381: D40BOT.1 114.3,128.91 107.95,128.91 107.95,121.92 107.31,121.28 E40.2 106.68,120.65 100.97,114.94 100.97,33.97 106.05,28.89 T56.2
MQ2
  Bottom 0.381: 133.35,123.19 133.35,120.02 130.49,117.16 130.49,38.42 120.97,28.89 T57.2 | 133.35,123.19 D40TOP.13 | 133.35,123.19 133.99,123.19 E40.23
MQ3
  Top 0.381: T58.2 129.86,28.89 123.51,35.56 117.79,39.69 117.79,119.38 E40.12 120.02,121.28 120.65,121.92 120.65,124.46 121.92,125.73 121.92,128.91 D40BOT.6
MQ4
  Bottom 0.381: T59.2 146.37,28.89 146.37,26.35 147,25.72 160.97,25.72 160.97,34.61 166.05,39.69 166.05,56.83 156.53,66.36 156.53,114.62 147.96,123.19 E40.33 146.69,123.83 146.69,125.09 144.78,125.09 141.6,128.27 141.6,128.91 D40TOP.18
MQ5
  Top 0.381: T60.2 163.51,24.45 165.42,22.54 165.42,16.51 164.78,15.88 139.7,15.88 139.7,118.75 137.79,120.65 E40.26 136.53,121.28 135.89,121.92 135.89,128.27 136.53,128.91 D40BOT.15
MQ6
  Bottom 0.381: T61.2 174.94,28.89 174.94,26.35 175.58,25.72 189.55,25.72 189.55,34.61 202.25,47.31 202.25,117.79 204.47,120.02 204.47,122.56 205.1,123.19 F40.9 206.38,123.83 E40TOP.5
MQ7
  Top 0.381: 194.31,120.97 F40.2 | T62.2 192.09,24.45 193.99,22.54 193.99,16.51 193.36,15.88 174.94,15.88 174.94,56.2 185.74,66.99 185.74,115.25 191.77,120.97 194.31,120.97 | 194.31,120.97 194.31,128.91 200.03,128.91 E40BOT.1
MQ8
  Bottom 0.381: T63.2 216.22,28.89 216.22,19.05 219.39,15.88 223.84,15.88 223.84,56.2 218.12,61.91 218.12,117.47 222.25,120.02 222.25,122.56 222.88,123.19 F40.23 222.88,123.83 219.71,127 219.71,128.27 219.07,128.91 E40TOP.13
MQ9
  Top 0.381: E40BOT.6 207.65,128.91 207.65,125.09 207.01,124.46 207.01,121.92 207.65,121.28 F40.12
  Bottom 0.381: T64.2 220.66,29.53 222.57,31.43 222.57,42.86 220.66,44.77 203.52,44.77 203.52,116.2 207.65,120.65 F40.12
MQ10
  Bottom 0.381: E40TOP.18 227.33,128.91 227.33,128.27 227.97,127.64 235.59,127.64 235.59,123.83 F40.33 236.22,123.19 240.66,123.19 241.3,122.56 241.3,35.24 T65.2
MQ11
  Top 0.381: T66.2 249.24,29.53 237.81,40.96 237.81,77.15 226.69,88.27 226.69,120.65 F40.26 225.43,121.28 224.79,121.92 224.79,124.46 222.88,126.36 222.88,128.27 222.25,128.91 E40BOT.15
N$1
  Top 0.381: T1.3 6.03,113.35 6.03,109.54 DF0.B
N$2
  Bottom 0.381: T2.3 19.37,113.98 20,113.35 20,109.54 DF1.B
N$3
  Bottom 0.381: T3.3 34.61,113.35 34.61,109.54 DF2.B
N$4
  Top 0.381: T4.3 47.94,113.98 48.58,113.35 48.58,109.54 IF0.B
N$5
  Top 0.381: T5.3 63.18,113.35 63.18,109.54 IF1.B
N$6
  Top 0.381: T6.3 79.06,110.17 IF2.B
N$7
  Top 0.381: T7.3 91.76,113.35 91.76,109.54 PC0.B
N$8
  Top 0.381: T8.3 105.09,113.98 105.73,113.35 105.73,109.54 PC1.B
N$9
  Top 0.381: T9.3 120.33,113.35 120.33,109.54 PC2.B
N$10
  Top 0.381: T10.3 133.67,113.98 134.3,113.35 134.3,109.54 PC3.B
N$11
  Top 0.381: T11.3 148.91,113.35 148.91,109.54 PC4.B
N$12
  Top 0.381: T12.3 162.24,113.98 162.88,113.35 162.88,109.54 PC5.B
N$13
  Top 0.381: T13.3 177.48,113.35 177.48,109.54 PC6.B
N$14
  Top 0.381: T14.3 190.82,113.98 191.45,113.35 191.45,109.54 PC7.B
N$15
  Top 0.381: T15.3 206.06,113.35 206.06,109.54 PC8.B
N$16
  Top 0.381: T16.3 219.39,110.17 PC9.B
N$17
  Top 0.381: T17.3 234.63,113.35 234.63,109.54 PC10.B
N$18
  Top 0.381: T18.3 247.97,113.98 248.6,113.35 248.6,109.54 PC11.B
N$19
  Top 0.381: T19.3 91.76,91.12 91.76,87.31 MA0.B
N$20
  Top 0.381: T20.3 105.09,91.76 105.73,91.12 105.73,87.31 MA1.B
N$21
  Top 0.381: T21.3 120.33,91.12 120.33,87.31 MA2.B
N$22
  Top 0.381: T22.3 133.67,91.76 134.3,91.12 134.3,87.31 MA3.B
N$23
  Top 0.381: T23.3 148.91,91.12 148.91,87.31 MA4.B
N$24
  Top 0.381: T24.3 162.24,91.76 162.88,91.12 162.88,87.31 MA5.B
N$25
  Top 0.381: T25.3 177.48,91.12 177.48,87.31 MA6.B
N$26
  Top 0.381: T26.3 190.82,91.76 191.45,91.12 191.45,87.31 MA7.B
N$27
  Top 0.381: T27.3 206.06,91.12 206.06,87.31 MA8.B
N$28
  Top 0.381: T28.3 219.39,91.76 220.03,91.12 220.03,87.31 MA9.B
N$29
  Top 0.381: T29.3 234.63,91.12 234.63,87.31 MA10.B
N$30
  Top 0.381: T30.3 247.97,91.76 248.6,91.12 248.6,87.31 MA11.B
N$31
  Top 0.381: T31.3 91.76,68.9 91.76,65.09 MB0.B
N$32
  Top 0.381: T32.3 105.09,69.53 105.73,68.9 105.73,65.09 MB1.B
N$33
  Top 0.381: T33.3 120.33,68.9 120.33,65.09 MB2.B
N$34
  Top 0.381: T34.3 133.67,69.53 134.3,68.9 134.3,65.09 MB3.B
N$35
  Top 0.381: T35.3 148.91,68.9 148.91,65.09 MB4.B
N$36
  Top 0.381: T36.3 162.24,69.53 162.88,68.9 162.88,65.09 MB5.B
N$37
  Top 0.381: T37.3 177.48,68.9 177.48,65.09 MB6.B
N$38
  Top 0.381: T38.3 190.82,65.72 MB7.B
N$39
  Bottom 0.381: T39.3 206.06,68.9 206.06,65.09 MB8.B
N$40
  Top 0.381: T40.3 219.39,69.53 220.03,68.9 220.03,65.09 MB9.B
N$41
  Top 0.381: T41.3 234.63,68.9 234.63,65.09 MB10.B
N$42
  Top 0.381: T42.3 247.97,69.53 248.6,68.9 248.6,65.09 MB11.B
N$43
  Top 0.381: T43.3 91.76,46.67 91.76,42.86 AC0.B
N$44
  Top 0.381: T44.3 105.09,47.31 105.73,46.67 105.73,42.86 AC1.B
N$45
  Bottom 0.381: T45.3 120.33,46.67 120.33,42.86 AC2.B
N$46
  Top 0.381: T46.3 133.67,47.31 134.3,46.67 134.3,42.86 AC3.B
N$47
  Top 0.381: T47.3 148.91,46.67 148.91,42.86 AC4.B
N$48
  Top 0.381: T48.3 162.24,47.31 162.88,46.67 162.88,42.86 AC5.B
N$49
  Top 0.381: T49.3 177.48,46.67 177.48,42.86 AC6.B
N$50
  Top 0.381: T50.3 190.82,47.31 191.45,46.67 191.45,42.86 AC7.B
N$51
  Top 0.381: T51.3 206.06,46.67 206.06,42.86 AC8.B
N$52
  Top 0.381: T52.3 219.39,47.31 220.03,46.67 220.03,42.86 AC9.B
N$53
  Bottom 0.381: T53.3 234.63,46.67 234.63,42.86 AC10.B
N$54
  Top 0.381: T54.3 248.6,45.4 248.6,42.86 AC11.B
N$55
  Top 0.381: T55.3 91.12,26.99 91.76,26.35 91.76,21.91 MQ0.B
N$56
  Top 0.381: T56.3 105.09,26.35 105.73,25.72 105.73,21.91 MQ1.B
N$57
  Top 0.381: T57.3 119.7,26.99 120.33,26.35 120.33,21.91 MQ2.B
N$58
  Top 0.381: T58.3 133.67,26.35 134.3,25.72 134.3,21.91 MQ3.B
N$59
  Top 0.381: T59.3 148.27,26.99 148.91,26.35 148.91,21.91 MQ4.B
N$60
  Bottom 0.381: T60.3 162.24,26.35 162.88,25.72 162.88,21.91 MQ5.B
N$61
  Top 0.381: T61.3 176.85,26.99 177.48,26.35 177.48,21.91 MQ6.B
N$62
  Bottom 0.381: T62.3 190.82,26.35 191.45,25.72 191.45,21.91 MQ7.B
N$63
  Top 0.381: T63.3 205.42,26.99 206.06,26.35 206.06,21.91 MQ8.B
N$64
  Top 0.381: T64.3 219.39,26.35 220.03,25.72 220.03,21.91 MQ9.B
N$65
  Top 0.381: T65.3 234,26.99 234.63,26.35 234.63,21.91 MQ10.B
N$66
  Top 0.381: T66.3 247.97,26.35 248.6,25.72 248.6,21.91 MQ11.B
N$67
  Top 0.381: T67.3 5.08,24.77 5.71,24.13 5.71,20.32 SC0.B
N$68
  Top 0.381: T68.3 19.68,25.4 20.32,24.77 20.32,20.32 SC1.B
N$69
  Bottom 0.381: T69.3 33.66,24.77 34.29,24.13 34.29,20.32 SC2.B
N$70
  Bottom 0.381: T70.3 48.26,25.4 48.9,24.77 48.9,20.32 SC3.B
N$71
  Bottom 0.381: T71.3 62.23,24.77 62.87,24.13 62.87,20.32 SC4.B
N$72
  Top 0.381: T72.3 76.52,47.31 77.15,46.67 77.15,42.86 LINK.B
N$73
  Bottom 0.381: T73.3 355.92,107 361.63,107 ION.B
N$74
  Bottom 0.381: T74.3 361.63,95.57 361.63,96.2 362.9,97.47 PAUSE.B
N$75
  Top 0.381: T75.3 355.92,84.77 361.63,84.77 RUN.B
N$76
  Bottom 0.381: T76.3 342.58,108.9 FETCH.B
N$77
  Bottom 0.381: T77.3 335.6,98.11 EXECUTE.B
N$78
  Top 0.381: T78.3 342.58,86.68 DEFER.B
N$79
  Bottom 0.381: T79.3 335.6,75.88 WORDCOUNT.B
N$80
  Bottom 0.381: T80.3 342.58,64.45 CURRENTADDRESS.B
N$81
  Bottom 0.381: T81.3 335.6,53.66 BREAK.B
N$82
  Top 0.381: T82.3 314.01,108.9 AND.B
N$83
  Bottom 0.381: T83.3 307.02,98.11 TAD.B
N$84
  Bottom 0.381: T84.3 314.01,86.68 ISZ.B
N$85
  Bottom 0.381: T85.3 307.02,75.88 DCA.B
N$86
  Bottom 0.381: T86.3 314.01,64.45 JMS.B
N$87
  Bottom 0.381: T87.3 307.02,53.66 JMP.B
N$88
  Bottom 0.381: T88.3 314.01,42.23 IOT.B
N$89
  Bottom 0.381: T89.3 307.02,31.43 OPR.B
OPR
  Top 0.381: T89.2 316.55,30.16 327.98,41.59 327.98,120.65 D40.16 328.3,121.28 328.93,121.92 328.93,127 330.2,128.27 F40BOT.11
PAUSE
  Bottom 0.381: 344.81,125.09 344.17,124.46 344.17,118.11 356.87,118.11 365.44,109.54 365.44,105.73 361,101.28 361,96.84 T74.2 | 344.81,125.09 347.35,125.09 347.35,123.83 D40.31 | 344.81,125.09 342.9,125.09 340.36,127.64 340.36,128.27 339.73,128.91 F40TOP.17
PC0
  Top 0.381: T7.2 99.69,116.2 106.68,123.19 E40.1
  Bottom 0.381: D40TOP.1 114.3,128.91 107.31,128.91 107.31,123.83 E40.1
PC1
  Top 0.381: D40BOT.5 120.65,128.91 120.02,128.27 120.02,126.36 118.11,124.46 118.11,121.92 117.47,121.28 E40.10 112.08,116.2 T8.2
PC2
  Bottom 0.381: 120.65,124.46 120.02,123.83 E40.11 | 120.65,124.46 121.92,125.73 121.92,128.91 D40TOP.6 | T9.2 120.65,124.46
PC3
  Top 0.381: T10.2 134.94,116.52 135.25,117.79 135.25,120.65 E40.24 133.99,121.28 133.35,121.92 133.35,124.46 134.62,125.73 134.62,128.91 D40BOT.14
PC4
  Bottom 0.381: T11.2 149.54,115.89 152.08,115.89 152.08,101.92 153.35,100.65 153.35,70.17 151.45,68.26 139.38,68.26 139.38,119.06 138.43,120.02 138.43,122.56 137.79,123.19 E40.25 136.53,123.83 135.25,125.09 135.25,128.91 D40TOP.14
PC5
  Top 0.381: 148.59,120.65 147.96,120.65 E40.34 | 148.59,120.65 149.86,120.65 153.99,116.52 163.51,116.52 T12.2 | 148.59,120.65 148.59,128.91 142.88,128.91 D40BOT.19
PC6
  Bottom 0.381: T13.2 178.12,116.52 188.91,116.84 F40.1 196.22,123.83 196.22,125.09 200.03,128.91 E40TOP.1
PC7
  Top 0.381: 204.47,120.02 205.1,120.65 F40.10 | 204.47,120.02 203.84,119.38 202.25,116.52 192.09,116.52 T14.2 | 204.47,120.02 204.47,124.46 205.74,125.73 205.74,128.27 206.38,128.91 E40BOT.5
PC8
  Bottom 0.381: T15.2 209.55,119.38 209.55,122.56 208.91,123.19 F40.11 207.65,123.83 207.65,128.91 E40TOP.6
PC9
  Top 0.381: 222.25,120.33 F40.24 | 222.25,120.33 222.25,118.11 T16.2 | 222.25,120.33 222.25,124.46 220.98,125.73 220.98,128.91 E40BOT.14
PC10
  Bottom 0.381: T17.2 234.63,116.52 227.33,116.52 227.33,122.56 226.69,123.19 F40.25 225.43,123.83 220.98,128.27 220.98,128.91 E40TOP.14
PC11
  Top 0.381: 237.49,120.02 236.85,120.65 F40.34 | 237.49,120.02 240.98,116.52 249.24,116.52 T18.2 | 237.49,120.02 237.49,128.91 228.6,128.91 E40BOT.19
RUN
  Top 0.381: T75.2 348.93,90.49 348.93,111.44 349.25,112.71 349.25,122.56 349.88,123.19 D40.33
  Bottom 0.381: F40TOP.18 341.63,128.91 341.63,128.27 343.54,126.36 349.88,126.36 349.88,123.83 D40.33
SC0
  Bottom 0.381: 36.83,126.36 34.92,128.27 C40TOP.5 | 36.83,126.36 38.1,125.09 38.1,120.02 35.56,117.47 32.07,117.47 32.07,53.66 6.35,27.94 T67.2 | 36.83,126.36 36.83,125.73 34.92,123.83 C40.9
SC1
  Top 0.381: 22.86,118.75 23.5,118.75 23.5,120.65 C40.2 | 22.86,118.75 6.35,118.75 3.49,115.89 3.49,42.55 20.32,27.3 T68.2 | 22.86,118.75 22.86,128.91 28.57,128.91 C40BOT.1
SC2
  Top 0.381: T69.2 34.92,27.94 53.34,46.35 53.34,122.56 52.7,123.19 C40.23
  Bottom 0.381: C40TOP.13 47.62,128.91 48.26,128.27 48.26,127 51.44,123.83 C40.23
SC3
  Top 0.381: C40BOT.6 36.83,128.91 36.83,125.73 38.1,124.46 38.1,121.92 37.47,121.28 C40.12
  Bottom 0.381: C40.12 34.92,119.06 30.8,119.06 30.8,113.98 3.81,83.82 3.81,15.88 36.2,15.88 37.47,17.14 37.47,27.3 T70.2
SC4
  Bottom 0.381: 55.88,125.09 55.88,128.91 C40TOP.18 | 55.88,125.09 55.88,119.38 50.16,119.38 46.67,115.89 46.67,44.77 63.5,27.94 T71.2 | 55.88,125.09 62.87,125.09 64.14,123.83 C40.33
TAD
  Top 0.381: F40BOT.2 315.6,128.91 315.6,128.27 312.42,125.09 311.15,125.09 311.15,121.92 311.79,121.28 D40.4
  Bottom 0.381: T83.2 316.55,96.84 317.82,98.11 317.82,119.06 318.77,120.02 318.77,124.46 318.13,125.09 313.69,125.09 313.69,121.92 313.06,121.28 D40.4
WC
  Top 0.381: F40BOT.17 339.73,128.91 340.36,128.27 340.36,127.64 342.9,125.09 344.17,125.09 344.17,121.92 344.81,121.28 D40.30
  Bottom 0.381: T79.2 341.31,74.61 341.31,72.71 342.58,71.44 368.3,71.44 368.3,107.95 356.87,119.38 346.07,119.38 346.07,120.65 D40.30

## Text on the board
Bottom: PDP-8/I Light Board 50045108 | 5404519